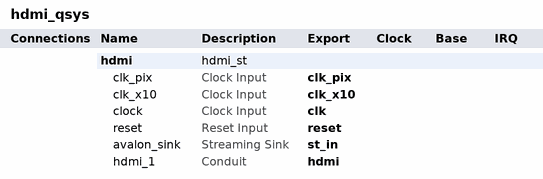
[diagram p0: system contents]
# Platform Designer (Qsys) system hdmi_qsys, MAX 10 10M50SAE144C8G
# Parameters at their usual value, and those the tool derives, are not listed.
package require qsys
create_system hdmi_qsys
set_project_property DEVICE_FAMILY {MAX 10}
set_project_property DEVICE 10M50SAE144C8G

add_instance hdmi hdmi_st 1.0
set_instance_parameter_value hdmi horz_back_porch 112
set_instance_parameter_value hdmi horz_front_porch 18
set_instance_parameter_value hdmi horz_pix 1024
set_instance_parameter_value hdmi horz_sync 60
set_instance_parameter_value hdmi vert_back_porch 112
set_instance_parameter_value hdmi vert_front_porch 18
set_instance_parameter_value hdmi vert_pix 600
set_instance_parameter_value hdmi vert_sync 60

# exported interfaces
add_interface clk clock sink
set_interface_property clk EXPORT_OF hdmi.clock
add_interface clk_pix clock sink
set_interface_property clk_pix EXPORT_OF hdmi.clk_pix
add_interface clk_x10 clock sink
set_interface_property clk_x10 EXPORT_OF hdmi.clk_x10
add_interface hdmi conduit end
set_interface_property hdmi EXPORT_OF hdmi.hdmi_1
add_interface reset reset sink
set_interface_property reset EXPORT_OF hdmi.reset
add_interface st_in avalon_streaming sink
set_interface_property st_in EXPORT_OF hdmi.avalon_sink

set_interconnect_requirement {$system} qsys_mm.clockCrossingAdapter HANDSHAKE
set_interconnect_requirement {$system} qsys_mm.enableEccProtection FALSE
set_interconnect_requirement {$system} qsys_mm.insertDefaultSlave FALSE
set_interconnect_requirement {$system} qsys_mm.maxAdditionalLatency 1

save_system hdmi_qsys.qsys
